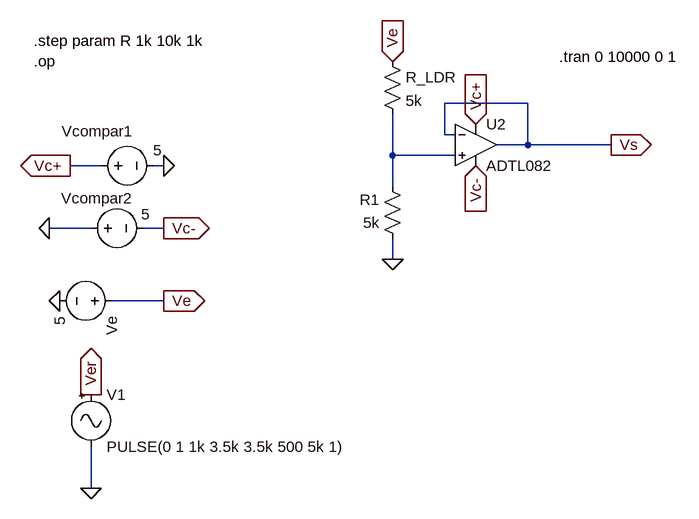
[diagram p0: schematic Draft1_1.asc]
Draft1_1.asc, the LTspice schematic file:
Version 4
SHEET 1 880 684
WIRE 320 -80 192 -80
WIRE 192 -32 192 -80
WIRE 208 -32 192 -32
WIRE 320 -16 320 -80
WIRE 320 -16 272 -16
WIRE 448 -16 320 -16
WIRE 112 0 112 -64
WIRE 208 0 112 0
WIRE -336 16 -384 16
WIRE -240 16 -256 16
WIRE 112 48 112 0
WIRE -352 112 -416 112
WIRE -240 112 -272 112
WIRE 112 160 112 128
WIRE -240 224 -320 224
WIRE -352 512 -352 448
FLAG 112 160 0
FLAG -416 112 0
FLAG -240 16 0
FLAG -384 16 Vc+
IOPIN -384 16 Out
FLAG -240 112 Vc-
IOPIN -240 112 Out
FLAG 240 -48 Vc+
IOPIN 240 -48 In
FLAG 240 16 Vc-
IOPIN 240 16 In
FLAG 448 -16 Vs
IOPIN 448 -16 Out
FLAG -240 224 Ve
IOPIN -240 224 Out
FLAG -400 224 0
FLAG -352 512 0
FLAG -352 368 Ver
IOPIN -352 368 Out
FLAG 112 -144 Ve
IOPIN 112 -144 In
SYMBOL res 96 -160 R0
SYMATTR InstName R_LDR
SYMATTR Value 5k
SYMBOL res 128 144 R180
WINDOW 0 36 76 Left 2
WINDOW 3 36 40 Left 2
SYMATTR InstName R1
SYMATTR Value 5k
SYMBOL voltage -352 16 R270
WINDOW 123 0 0 Left 2
WINDOW 39 0 0 Left 2
WINDOW 0 53 -45 VRight 2
WINDOW 3 24 96 VRight 2
SYMATTR InstName Vcompar1
SYMATTR Value 5
SYMBOL voltage -368 112 R270
WINDOW 123 0 0 Left 2
WINDOW 39 0 0 Left 2
WINDOW 0 46 -30 VRight 2
WINDOW 3 21 93 VRight 2
SYMATTR InstName Vcompar2
SYMATTR Value 5
SYMBOL voltage -304 224 R90
WINDOW 123 0 0 Left 2
WINDOW 39 24 44 Left 2
SYMATTR InstName Ve
SYMATTR Value 5
SYMBOL OpAmps\\ADTL082 240 -80 R0
SYMATTR InstName U2
SYMBOL Misc\\signal -352 352 R0
WINDOW 123 0 0 Left 0
WINDOW 39 0 0 Left 0
SYMATTR InstName V1
SYMATTR Value PULSE(0 1 1k 3.5k 3.5k 500 5k 1)
TEXT 368 -152 Left 2 !.tran 0 10000 0 1
TEXT -440 -176 Left 2 !.step param R 1k 10k 1k\n.op

The netlist it stands for:
* Draft1_1.asc
R_LDR Ve N001 5k
R1 0 N001 5k
Vcompar1 Vc+ 0 5
Vcompar2 0 Vc- 5
Ve Ve 0 5
XU2 N001 Vs Vc+ Vc- Vs ADTL082  ; pins In+ In- V+ V- OUT
V1 Ver 0 PULSE(0 1 1k 3.5k 3.5k 500 5k 1)
.tran 0 10000 0 1
.step param R 1k 10k 1k
.op
.lib ADI.lib
.backanno
.end